# EAGLE design photon-controller-v2 (EAGLE 7.7.0)
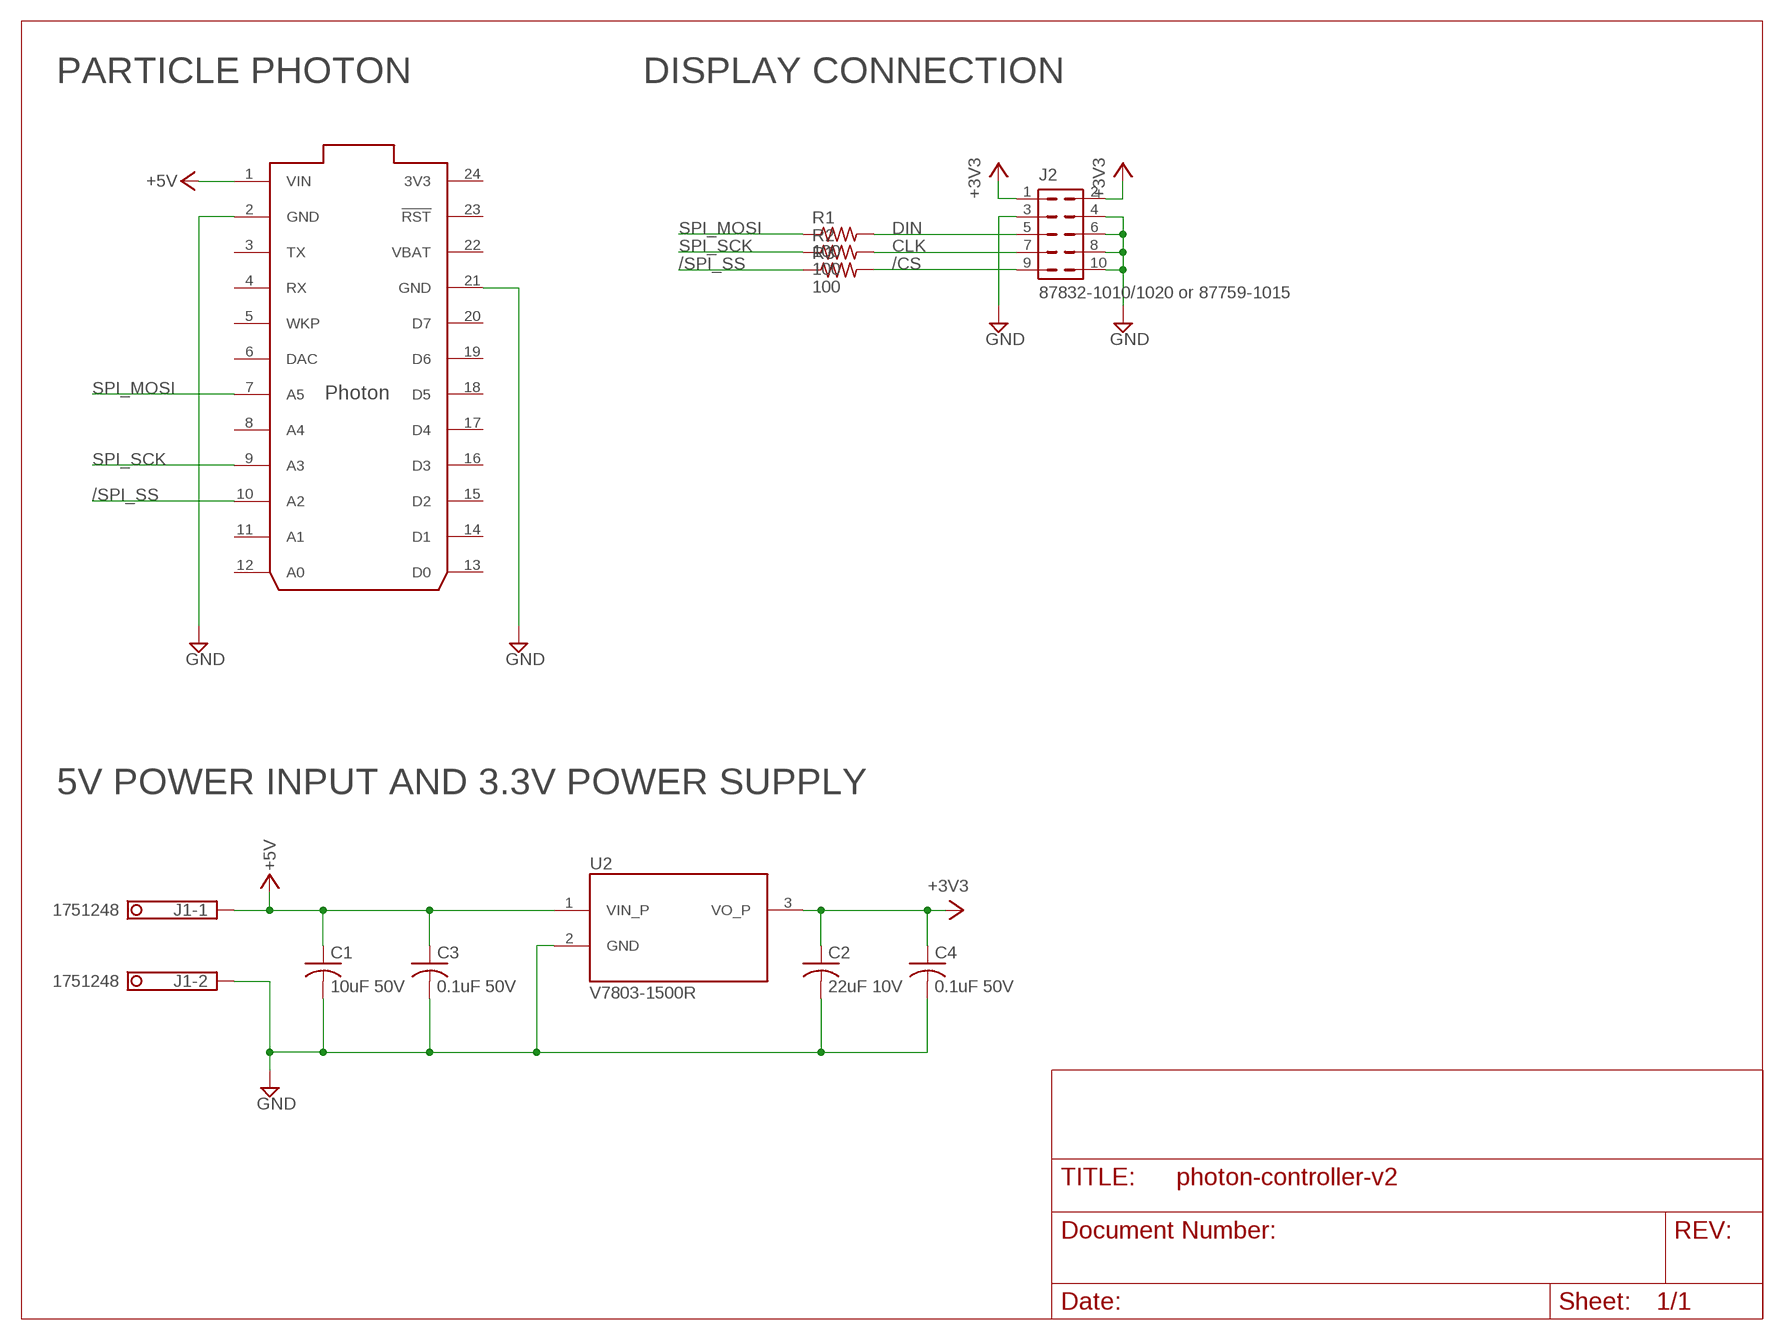
[diagram p0: schematic, sheet 1]

## Parts
C1  10uF 50V  C-USC1210K  [C1210K]
C2  22uF 10V  C-USC1206K  [C1206K]
C3  0.1uF 50V  C-USC1206K  [C1206K]
C4  0.1uF 50V  C-USC1206K  [C1206K]
J1  1751248  [1751248]
J2  87832-1010/1020 or 87759-1015  87832-10  [87832-10]
R1  100  R-US_R1206  [R1206]
R2  100  R-US_R1206  [R1206]
R3  100  R-US_R1206  [R1206]
U1  PHOTON_WITH_HEADERS  [PHOTON]
U2  V7803-1500R  [CONV_V7803-1500R]

## Nets
+3V3: C2.1 C4.1 J2.1 J2.2 U2.3(VO_P)
+5V: C1.1 C3.1 J1.1 U1.1(VIN) U2.1(VIN_P)
/CS: J2.9 R3.2
/SPI_SS: R3.1 U1.10(A2)
CLK: J2.7 R2.2
DIN: J2.5 R1.2
GND: C1.2 C2.2 C3.2 C4.2 J1.2 J2.3 J2.4 J2.6 J2.8 J2.10 U1.2(GND) U1.21(GND) U2.2(GND)
SPI_MOSI: R1.1 U1.7(A5)
SPI_SCK: R2.1 U1.9(A3)
Unconnected: U1.3(TX) U1.4(RX) U1.5(WKP) U1.6(DAC) U1.8(A4) U1.11(A1) U1.12(A0) U1.13(D0) U1.14(D1) U1.15(D2) U1.16(D3) U1.17(D4) U1.18(D5) U1.19(D6) U1.20(D7) U1.23(!RST)

## Notes on the sheet
- PARTICLE PHOTON | DISPLAY CONNECTION
- 5V POWER INPUT AND 3.3V POWER SUPPLY

## Power pins joined to a net without a drawn wire
3V3: U1.24(3V3)
VBAT: U1.22(VBAT)

## Library data of the parts
C1 = rcl:C-US: CAPACITOR, American symbol; MFR: KEMET; MFR_PART_NO: C1210C106K5RACTU
C2 = rcl:C-US: CAPACITOR, American symbol; MFR: KEMET; MFR_PART_NO: C1206C226K8RAC7800
C3 C4 = rcl:C-US: CAPACITOR, American symbol; MFR: KEMET; MFR_PART_NO: C1206S104M5RACTU
J1 = con-phoenix-350:1751248: MKDS 1/ 2-3,5 Printklemme Nennstrom: 10 A Bemessungsspannung: 160 V Raster: 3,5 mm Polzahl: 2 Montageart: Löten Anschlussart: Schraubanschluss Anschlussrichtung vom Leiter zur Platine: 0° Source: http://eshop.phoenixcontact.com .. 1751248.pdf; OC_FARNELL: unknown; OC_NEWARK: unknown
J2 = con-molex:87832-10: Milli-Grid Header 2.00mm (.079") Pitch; OC_FARNELL: unknown; OC_NEWARK: unknown
R1-R3 = rcl:R-US_: RESISTOR, American symbol
U1 = Particle:PHOTON
U2 = V7803-1500R:V7803-1500R; MANUFACTURER: CUI INC; PARTREV: 1.03; STANDARD: MANUFACTURER RECOMMENDATIONS

## Board
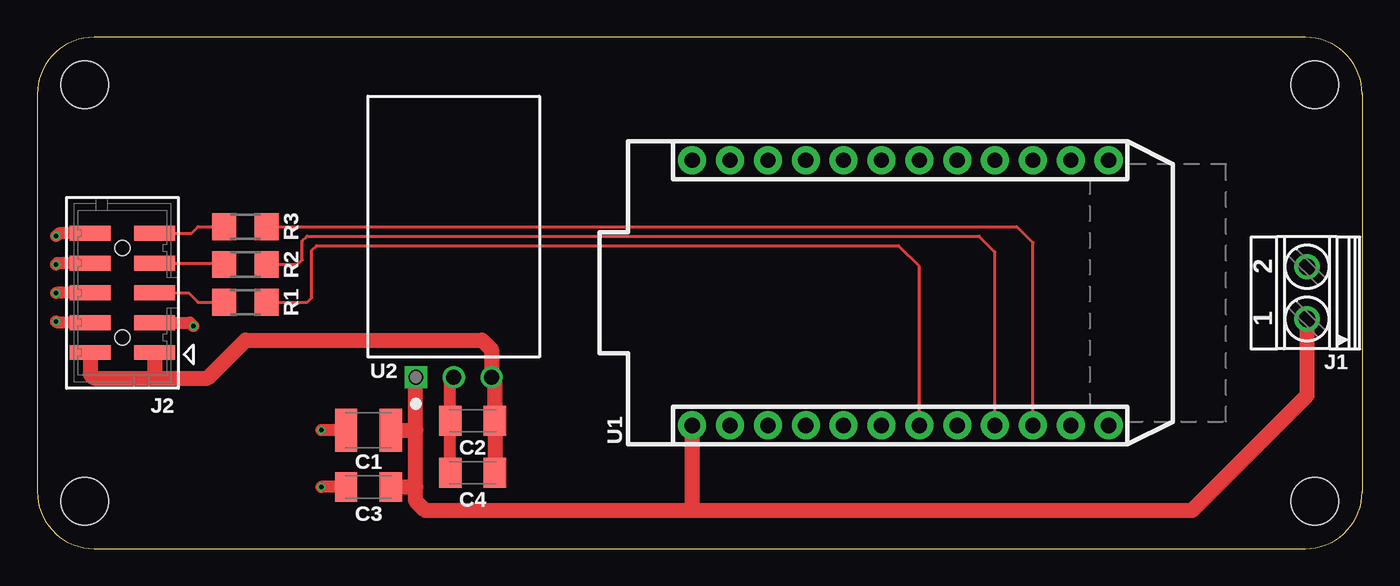
[diagram p1: board, top side]
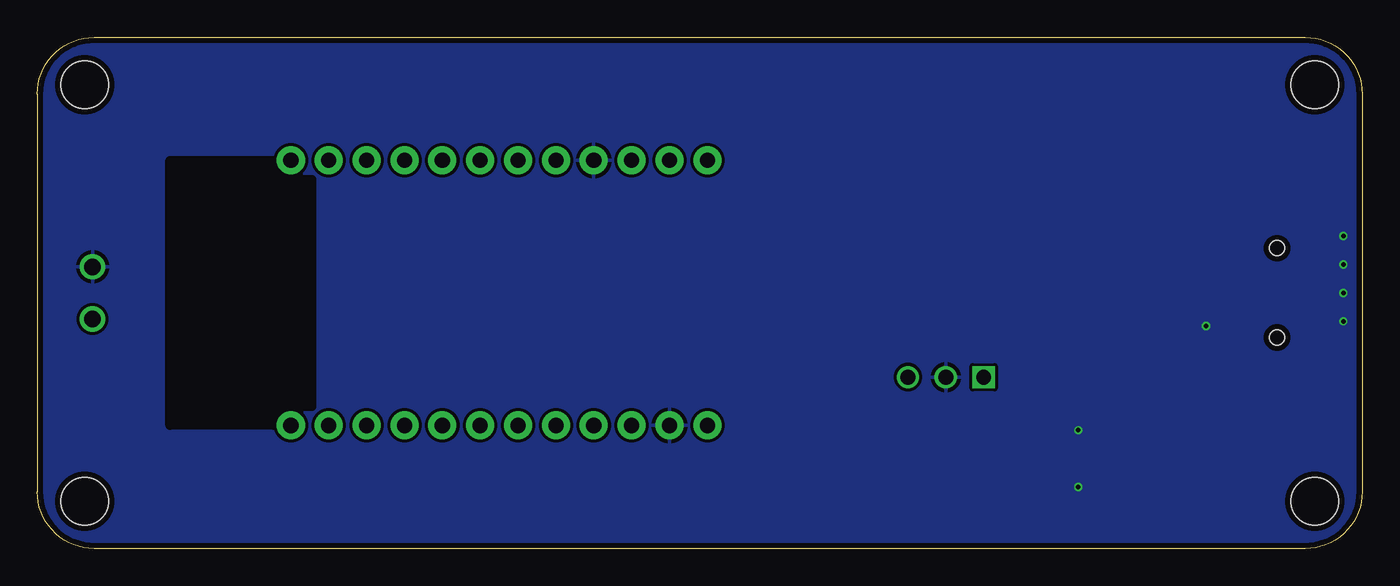
[diagram p2: board, bottom side, seen from below]

Size 88.9 x 34.29 mm. Coordinates in mm from the lower left corner, seen from the top.
Outline: 3.81,0 85.09,0 arc90 88.9,3.81 88.9,30.48 arc90 85.09,34.29 3.81,34.29 arc90 0,30.48 0,3.81 arc90 3.81,0
Copper layers (1*16): Top 0.035559375mm / dielectric 1.6mm / Bottom 0.035559375mm
Design rules "oshpark-2layer-2018": minimum track width 6mil, minimum drill 10mil, track to track 6mil, track to pad 6mil, pad to pad 6mil, via to via 6mil, smd to smd 6mil, copper to edge 15mil, drill to drill 6mil, minimum pad ring 5mil, minimum via ring 5mil, stop-mask expansion 2.5mil, vias tented up to drill 0mil, thermal gap 10mil
Holes 3.2 mm at 3.17,3.17 85.72,3.17 85.72,31.11 3.17,31.11
bRestrict: area 70.5,8.3 to 80,26

### Footprints (pad centres in the part's own frame; a part is rotated, then mirrored left to right if it is on the bottom)
C1210K = smd 1.5 x 2.9: 1 -1.5,0; 2 1.5,0
C1206K = smd 1.5 x 2: 1 -1.5,0; 2 1.5,0
1751248 = drill 1.1 pad 1.7: 1 -1.75,-0.1; 2 1.75,-0.1
87832-10 = smd 1 x 2.75: 1 -4,-2.15; 2 -4,2.15; 3 -2,-2.15; 4 -2,2.15; 5 0,-2.15; 6 0,2.15; 7 2,-2.15; 8 2,2.15; 9 4,-2.15; 10 4,2.15 | hole 1: -3,0; 3,0
R1206 = smd 1.6 x 1.803: 1 -1.422,0; 2 1.422,0
PHOTON = drill 1.016 pad 1.88: 1 1.27,32.258; 2 1.27,29.718; 3 1.27,27.178; 4 1.27,24.638; 5 1.27,22.098; 6 1.27,19.558; 7 1.27,17.018; 8 1.27,14.478; 9 1.27,11.938; 10 1.27,9.398; 11 1.27,6.858; 12 1.27,4.318; 13 19.05,4.318; 14 19.05,6.858; 15 19.05,9.398; 16 19.05,11.938; 17 19.05,14.478; 18 19.05,17.018; 19 19.05,19.558; 20 19.05,22.098; 21 19.05,24.638; 22 19.05,27.178; 23 19.05,29.718; 24 19.05,32.258
CONV_V7803-1500R = drill 1 square: 1 -10.1,2.54 | drill 1: 2 -10.1,0; 3 -10.1,-2.54

### Placement (x,y rotation side)
C1  22.23,7.94 180 top
C2  29.21,8.57 180 top
C3  22.23,4.13 180 top
C4  29.21,5.08 180 top
J1  85.09,17.14 90 top
J2  5.71,17.14 90 top
R1  13.97,16.51 180 top
R2  13.97,19.05 180 top
R3  13.97,21.59 180 top
U1  76.2,6.99 90 top
U2  27.94,21.59 90 top

### Tracks (layer width: path | path; a pad name or v marks a point on that pad's centre or on a via)
+3V3
  Top 0.813: 7.87,11.5 7.94,11.43 | 30.71,11.26 U2.3
  Top 1.016: J2.2 3.56,11.68 3.81,11.43 7.94,11.43 11.43,11.43 13.97,13.97 29.84,13.97 30.48,13.34 U2.3 | J2.1 7.87,11.5 | 30.71,11.26 C2.1 C4.1
+5V
  Top 0.813: 43.94,2.73 44.13,2.54
  Top 1.016: J1.1 85.19,10.26 77.47,2.54 44.13,2.54 26.04,2.54 25.4,3.17 25.4,4.13 | 25.4,4.13 25.4,7.94 | 25.4,7.94 U2.1 | C1.1 25.4,7.94 | C3.1 25.4,4.13 | U1.1 43.94,2.73
/CS
  Top 0.203: J2.9 10.35,21.14 10.79,21.59 R3.2
/SPI_SS
  Top 0.203: R3.1 65.72,21.59 66.8,20.51 U1.10
CLK
  Top 0.203: J2.7 12.45,19.14 R2.2
DIN
  Top 0.203: J2.5 10.16,17.14 10.79,16.51 R1.2
GND  (via drill 0.3)
  Top 0.813: J2.4 1.36,15.14 v1.27,15.24 | J2.6 v1.27,17.14 | J2.10 1.46,21.14 v1.27,20.95 | J2.8 1.36,19.14 v1.27,19.05 | J2.3 10.26,15.14 v10.48,14.92 | C1.2 v19.05,7.94 | C3.2 v19.05,4.13 | C4.2 C2.2 27.71,11.26 U2.2
  pour Bottom (isolate 0.203): 0,0 88.9,0 88.9,34.29 0,34.29
SPI_MOSI
  Top 0.203: R1.1 18.1,16.51 18.41,16.83 18.41,20 18.73,20.32 57.78,20.32 59.18,18.92 U1.7
SPI_SCK
  Top 0.203: R2.1 17.46,19.05 17.78,19.37 17.78,20.64 18.1,20.95 63.18,20.95 64.26,19.88 U1.9

### Text on the board
_tsilk: R3 | R2 | 2 | R1 | 1 | J1 | U2 | J2 | C2 | U1 | C1 | C4 | C3